# EAGLE schematic ASL2001 (EAGLE 6.2)
DATABASE: ./../../../../../Components/TinyCircuits_Part_Database.txt
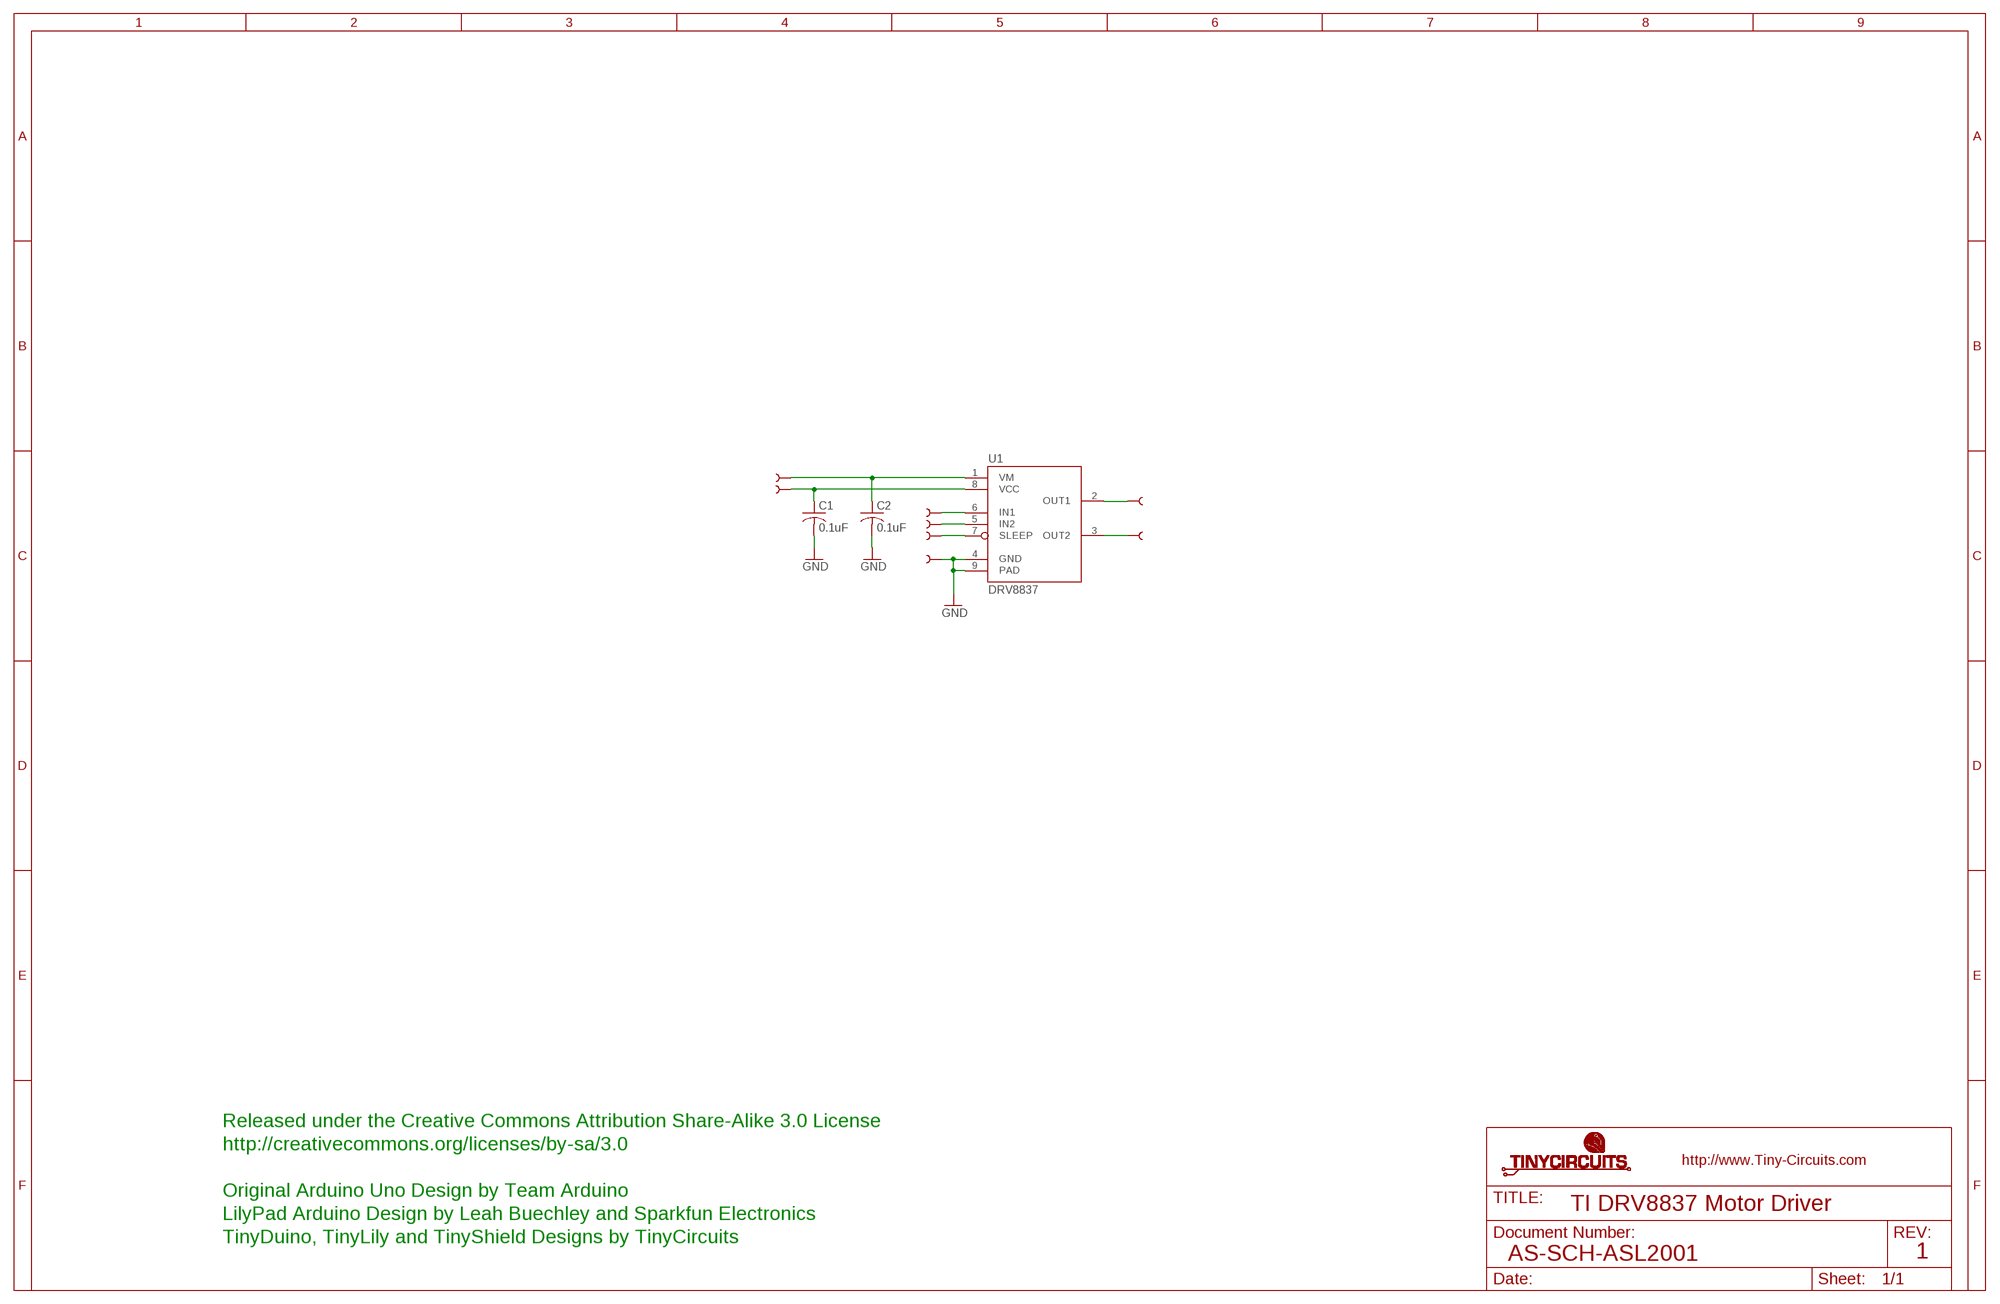
[diagram p0: schematic, sheet 1]

## Parts
C1  0.1uF  AS-ITM-00008  [C0402]
C2  0.1uF  AS-ITM-00008  [C0402]
U1  DRV8837  AS-ITM-00042  [WSON-8]
U$2  SEWTABTH_0402  [SEWTAP_TH_0402]
U$3  SEWTABTH_0402  [SEWTAP_TH_0402]
U$4  SEWTABTH_0402  [SEWTAP_TH_0402]
U$5  SEWTABTH_0402  [SEWTAP_TH_0402]
U$8  SEWTABTH_0402  [SEWTAP_TH_0402]
U$9  SEWTABTH_0402  [SEWTAP_TH_0402]
U$10  SEWTABTH_0402  [SEWTAP_TH_0402]
U$11  SEWTABTH_0402  [SEWTAP_TH_0402]

## Nets
GND: C1.2 C2.2 U1.4(GND) U1.9(PAD) U$9.1
N$3: C1.1 U1.8(VCC) U$2.1
N$4: U1.7(SLEEP) U$8.1
N$5: U1.5(IN2) U$5.1
N$6: U1.6(IN1) U$4.1
N$7: C2.1 U1.1(VM) U$3.1
N$9: U1.2(OUT1) U$10.1
N$10: U1.3(OUT2) U$11.1

## Notes on the sheet
- Released under the Creative Commons Attribution Share-Alike 3.0 License
- http://creativecommons.org/licenses/by-sa/3.0
- Original Arduino Uno Design by Team Arduino
- TI DRV8837 Motor Driver
- LilyPad Arduino Design by Leah Buechley and Sparkfun Electronics
- TinyDuino, TinyLily and TinyShield Designs by TinyCircuits
- AS-SCH-ASL2001 | 1

## Library data of the parts
C1 C2 = tinycircuits:AS-ITM-00008: CAP CER 0.1UF 16V 10% X5R 0402; PARTNO: AS-ITM-00008
U1 = tinycircuits:AS-ITM-00042: IC PWM MOTR DVR H-BRDG 8WSON; PARTNO: AS-ITM-00042
U$2-U$5 U$8-U$11 = tinycircuits:SEWTAB: TinyLily Sew Tab; BOM: EXCLUDE; DNP: T